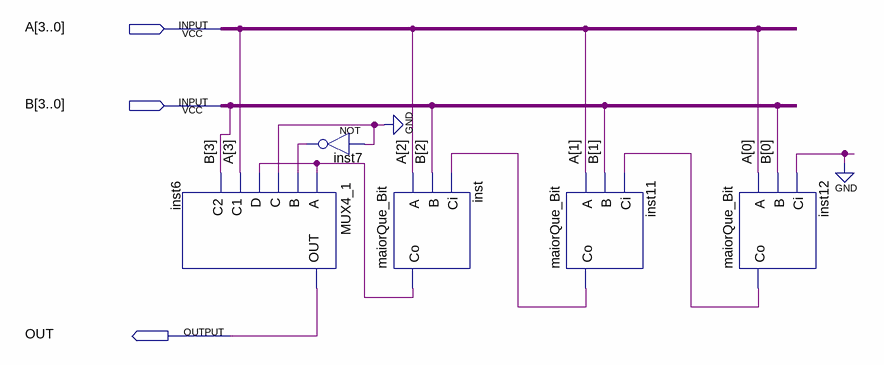
[diagram p0: schematic sheet]
// Quartus schematic maiorQue.bdf as structural Verilog: 5 symbols, 3 pins
module maiorQue (
  input  [3:0] A,
  input  [3:0] B,
  output OUT
);

  wire inst7_out, inst11_co, inst12_co, inst_co;

  MUX4_1 inst6 (.A(inst_co), .B(inst7_out), .C(1'b0), .D(inst_co), .C1(A[3]), .C2(B[3]), .OUT(OUT));
  not inst7 (inst7_out, 1'b0);
  maiorQue_Bit inst (.A(A[2]), .B(B[2]), .Ci(inst11_co), .Co(inst_co));
  maiorQue_Bit inst11 (.A(A[1]), .B(B[1]), .Ci(inst12_co), .Co(inst11_co));
  maiorQue_Bit inst12 (.A(A[0]), .B(B[0]), .Ci(1'b0), .Co(inst12_co));
endmodule
